# EAGLE design eCog102_uSD (EAGLE 6.6.0)
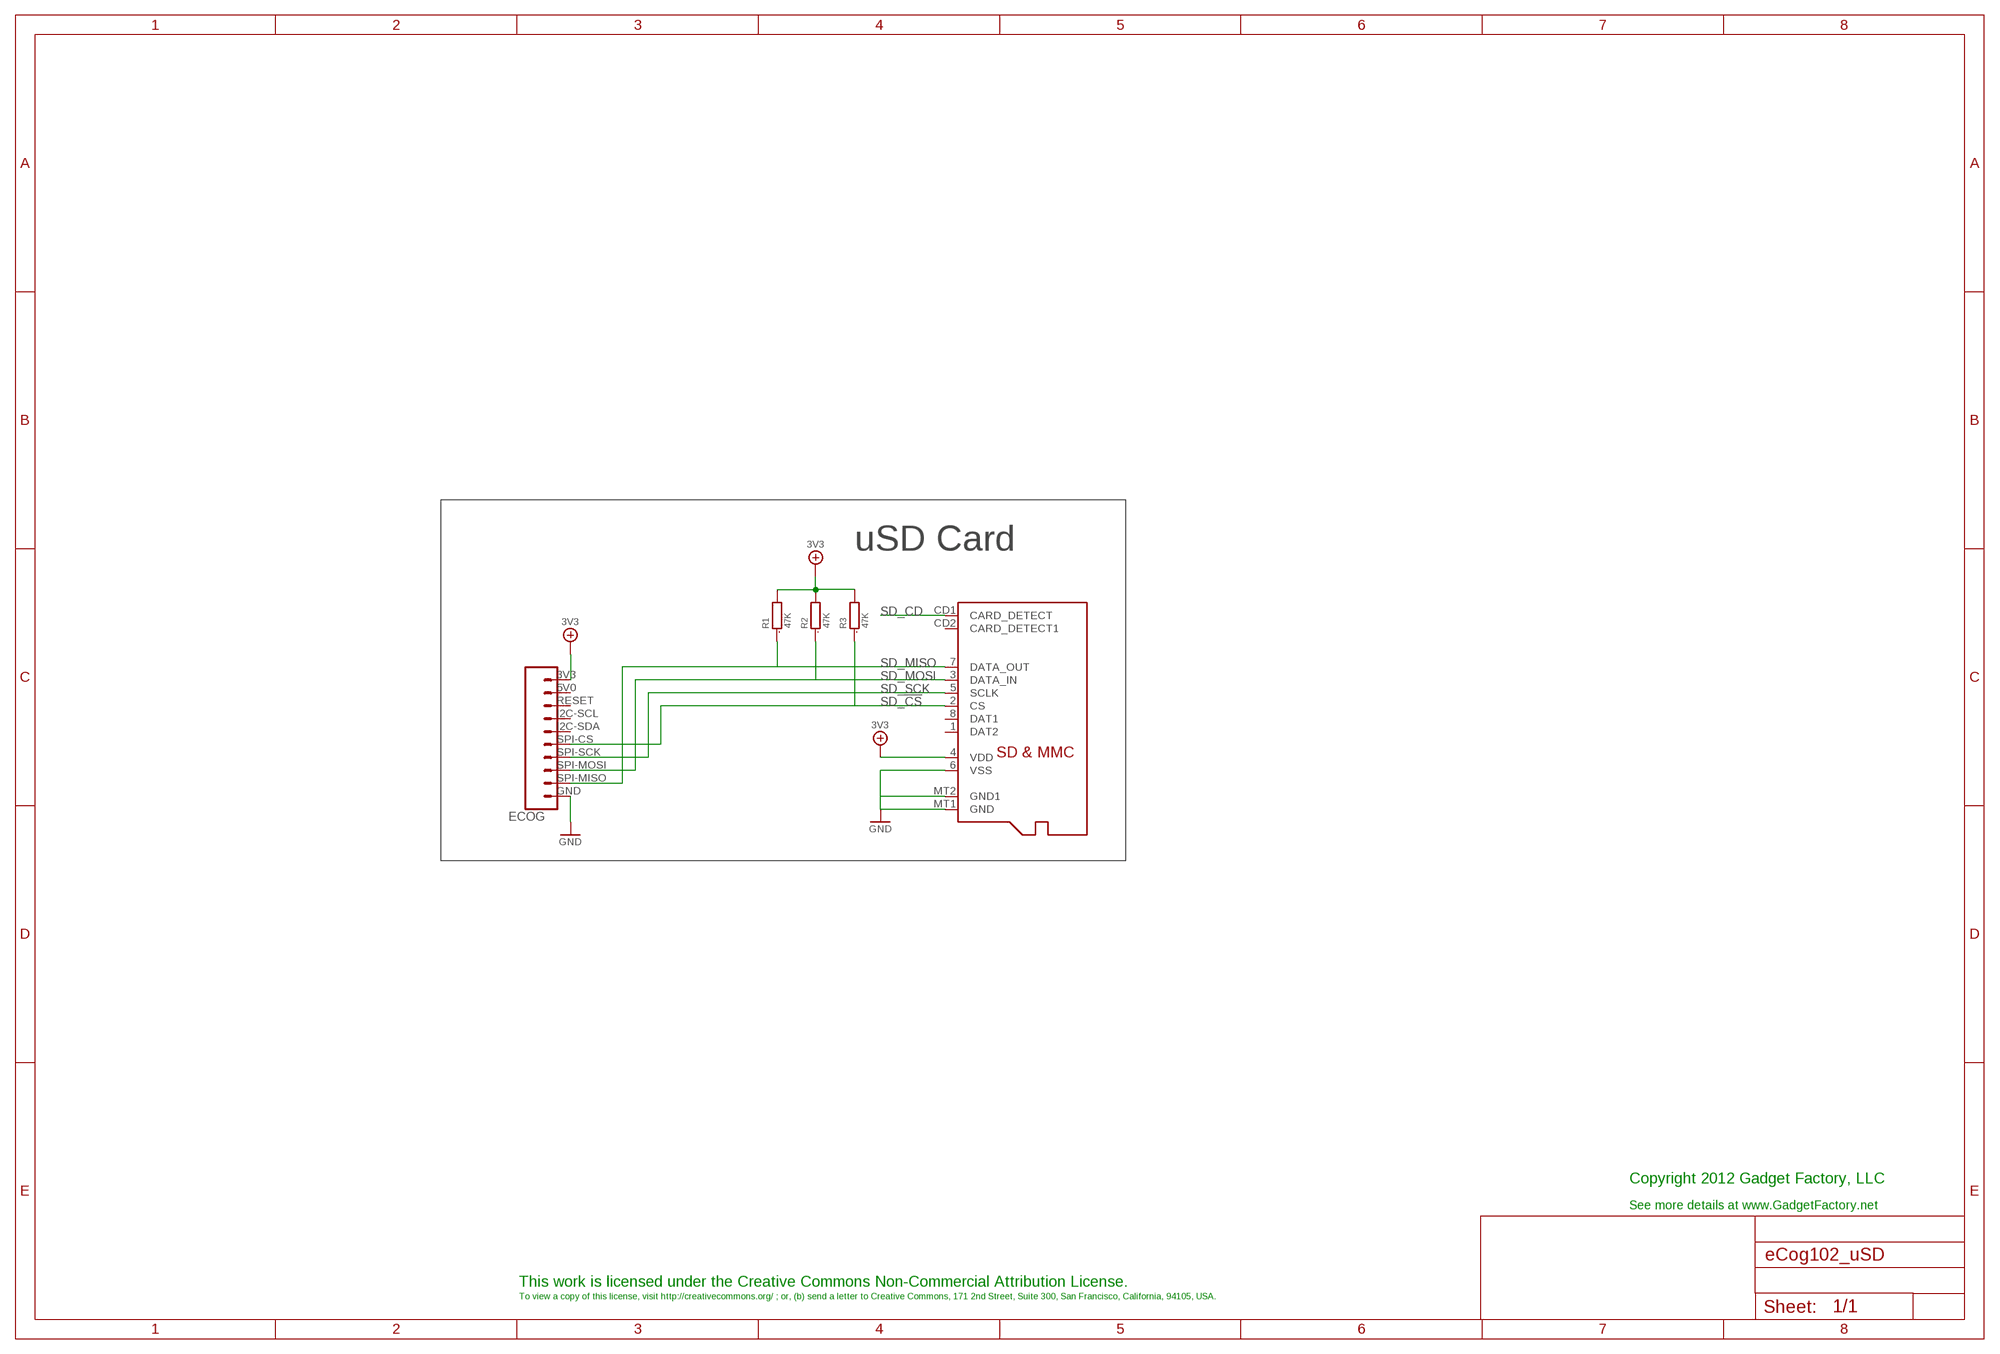
[diagram p0: schematic, sheet 1]

## Parts
ECOG  ECOG_BUSES_ROWECOG_BUSES_SMD  [ECOG_BUSES_SMD]
R1  47K  R0805  [0805]
R2  47K  R0805  [0805]
R3  47K  R0805  [0805]
SD1  MICROSD  [MICROSD]

## Nets
3V3: ECOG.3V3 R1.2 R2.2 R3.2 SD1.4(VDD)
GND: ECOG.GND SD1.6(VSS) SD1.MT1(GND) SD1.MT2(GND1)
SD_!CS: ECOG.SPI-CS R3.1 SD1.2(CS)
SD_CD: SD1.CD1(CARD_DETECT)
SD_MISO: ECOG.SPI-MISO R1.1 SD1.7(DATA_OUT)
SD_MOSI: ECOG.SPI-MOSI R2.1 SD1.3(DATA_IN)
SD_SCK: ECOG.SPI-SCK SD1.5(SCLK)
Unconnected: ECOG.5V0 ECOG.I2C-SCL ECOG.I2C-SDA ECOG.RESET SD1.1(DAT2) SD1.8(DAT1) SD1.CD2(CARD_DETECT1)

## Notes on the sheet
- uSD Card
- Copyright 2012 Gadget Factory, LLC
- See more details at www.GadgetFactory.net
- This work is licensed under the Creative Commons Non-Commercial Attribution License.
- To view a copy of this license, visit http://creativecommons.org/ ; or, (b) send a letter to Creative Commons, 171 2nd Street, Suite 300, San Francisco, California, 94105, USA.

## Library data of the parts
ECOG = eCogs:ECOG_BUSES_ROW; DIGIKEY: S1013EC-10-ND
R1-R3 = GadgetFactory_6.0:R: RESISTOR, European symbol; DIGIKEY: RMCF0805JT47K0CT-ND; PARTNO: RMCF0805JT47K0
SD1 = adafruit:MICROSD: Micro-SD / Transflash card holder with SPI pinout For the 3M # 2908-05WB-MG and/or 4UCON #19656 push-push type; DIGIKEY: 101-00660-68-6-1-ND; PARTNO: 101-00660-68-6

## Board
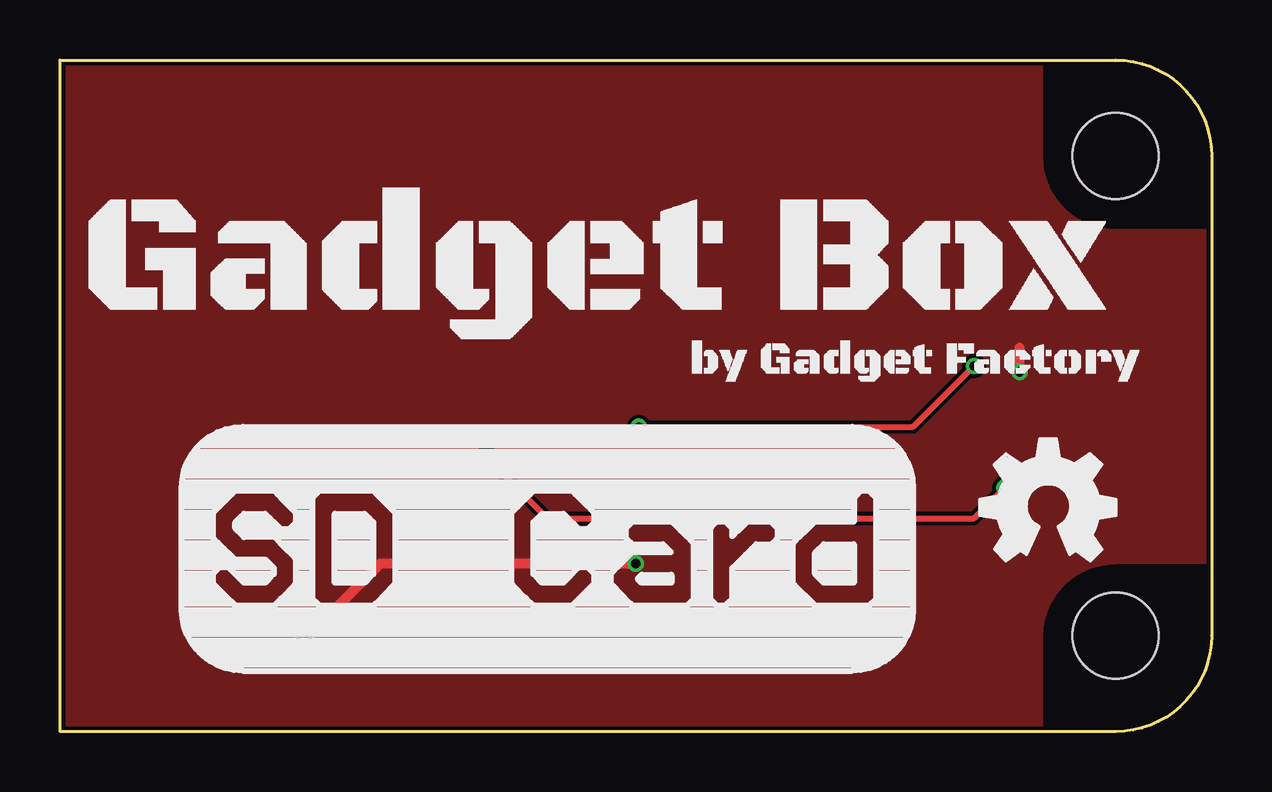
[diagram p1: board, top side]
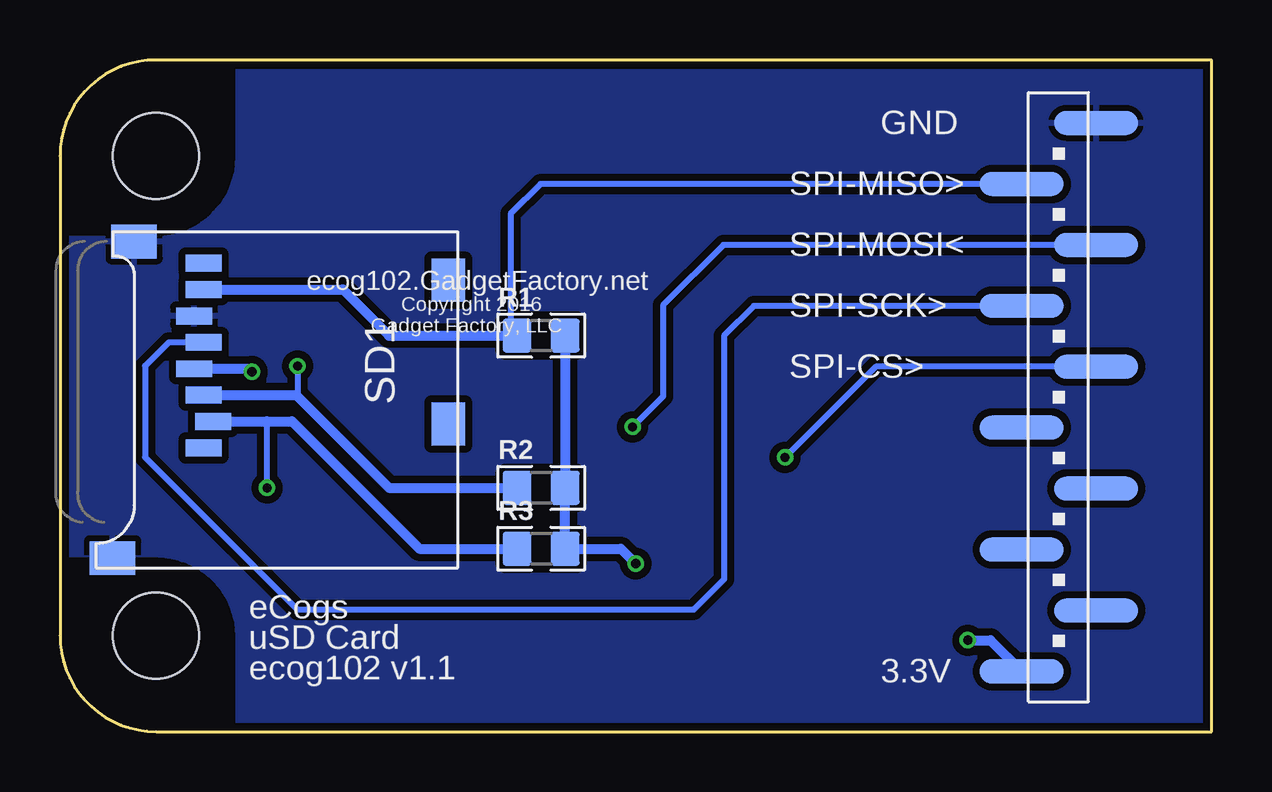
[diagram p2: board, bottom side, seen from below]

Size 48 x 28 mm. Coordinates in mm from the lower left corner, seen from the top.
Copper layers (1*16): Top 0.035mm / dielectric 1.5mm / Bottom 0.035mm
Design rules "hackvana": minimum track width 6mil, minimum drill 0.3mm, track to track 6mil, track to pad 6mil, pad to pad 6mil, via to via 6mil, smd to smd 0mil, copper to edge 6mil, drill to drill 6mil, minimum pad ring 10mil, minimum via ring 6mil, stop-mask expansion 2mil, vias tented up to drill 100mil, thermal gap 10mil

### Footprints (pad centres in the part's own frame; a part is rotated, then mirrored left to right if it is on the bottom)
ECOG_BUSES_SMD = smd 3.5 x 1 bottom: 3V3 7.909,2.51; 5V0 4.811,5.05; GND 4.811,25.37; I2C-SCL 4.811,10.13; I2C-SDA 7.909,12.67; RESET 7.909,7.59; SPI-CS 4.811,15.21; SPI-MISO 7.909,22.83; SPI-MOSI 4.811,20.29; SPI-SCK 7.909,17.75 | hole 3.6: 44,4; 44,24
0805 = smd 1.2 x 1.4: 1 -1,0; 2 1,0
MICROSD = smd 0.7 x 1.5: 1 9,-10.64; 2 7.9,-10.24; 3 6.8,-10.64; 4 5.7,-11.04; 5 4.6,-10.64; 6 3.5,-11.04; 7 2.4,-10.64; 8 1.3,-10.64 | smd 1.8 x 1.4: CD1 2,-0.44; CD2 8,-0.44 | smd 1.4 x 1.9: MT1 0.4,-13.54; MT2 13.6,-14.44

### Placement (x,y rotation side)
ECOG  0,0 0 top
R1  27.94,16.51 0 bottom
R2  27.94,10.16 0 bottom
R3  27.94,7.62 0 bottom
SD1  31.37,20.83 270 bottom
U$1  [GADGETBOX_TEXT]  22.48,19.3 0 top
U$2  [OSHW_FILLX200_NOTEXT]  38.35,7.11 0 top

### Tracks (layer width: path | path; a pad name or v marks a point on that pad's centre or on a via)
3V3  (via drill 0.38)
  Top 0.406: v40,15 40,16 | v24,7 13.35,7 v10.16,3.81
  Bottom 0.406: R1.2 R2.2 R3.2 24.62,7.62 v24,7 | SD1.4 40.13,15.13 v40,15 | v10.16,3.81 9.21,3.81 ECOG.3V3
  pour Top: -1.27,29.27 49.27,29.27 49.27,-1.27 -1.27,-1.27
GND
  pour Bottom (isolate 0.305): -2.54,30.54 50.54,30.54 50.54,-2.54 -2.54,-2.54
SD_!CS  (via drill 0.38)
  Top 0.254: v17.78,11.43 20.32,8.89 38.1,8.89 v39.37,10.16
  Bottom 0.254: v39.37,10.16 39.37,12.93 | ECOG.SPI-CS 14,15.21 v17.78,11.43
  Bottom 0.406: SD1.2 39.37,12.93 38.33,12.93 33.02,7.62 R3.1
SD_MISO
  Bottom 0.254: R1.1 29.21,16.78 29.21,21.59 27.97,22.83 ECOG.SPI-MISO
  Bottom 0.406: SD1.7 36.21,18.43 34.29,16.51 R1.1
SD_MOSI  (via drill 0.38)
  Top 0.254: v24.13,12.7 35.56,12.7 v38.1,15.24
  Bottom 0.254: v24.13,12.7 22.86,13.97 22.86,17.78 20.35,20.29 ECOG.SPI-MOSI | v38.1,15.24 38.1,13.97
  Bottom 0.406: SD1.3 38.16,14.03 38.1,13.97 34.29,10.16 R2.1
SD_SCK
  Bottom 0.254: SD1.5 43.46,16.23 44.45,15.24 44.45,11.43 38.1,5.08 21.59,5.08 20.32,6.35 20.32,16.51 19.08,17.75 ECOG.SPI-SCK

### Text on the board
bPlace: GND | SPI-MISO> | SPI-MOSI< | Copyright 2016 | ecog102.GadgetFactory.net | SPI-SCK> | Gadget Factory, LLC | SPI-CS> | eCogs | uSD Card | 3.3V | ecog102 v1.1